# Altium schematic sheet Reference sche.SchDoc
size A2
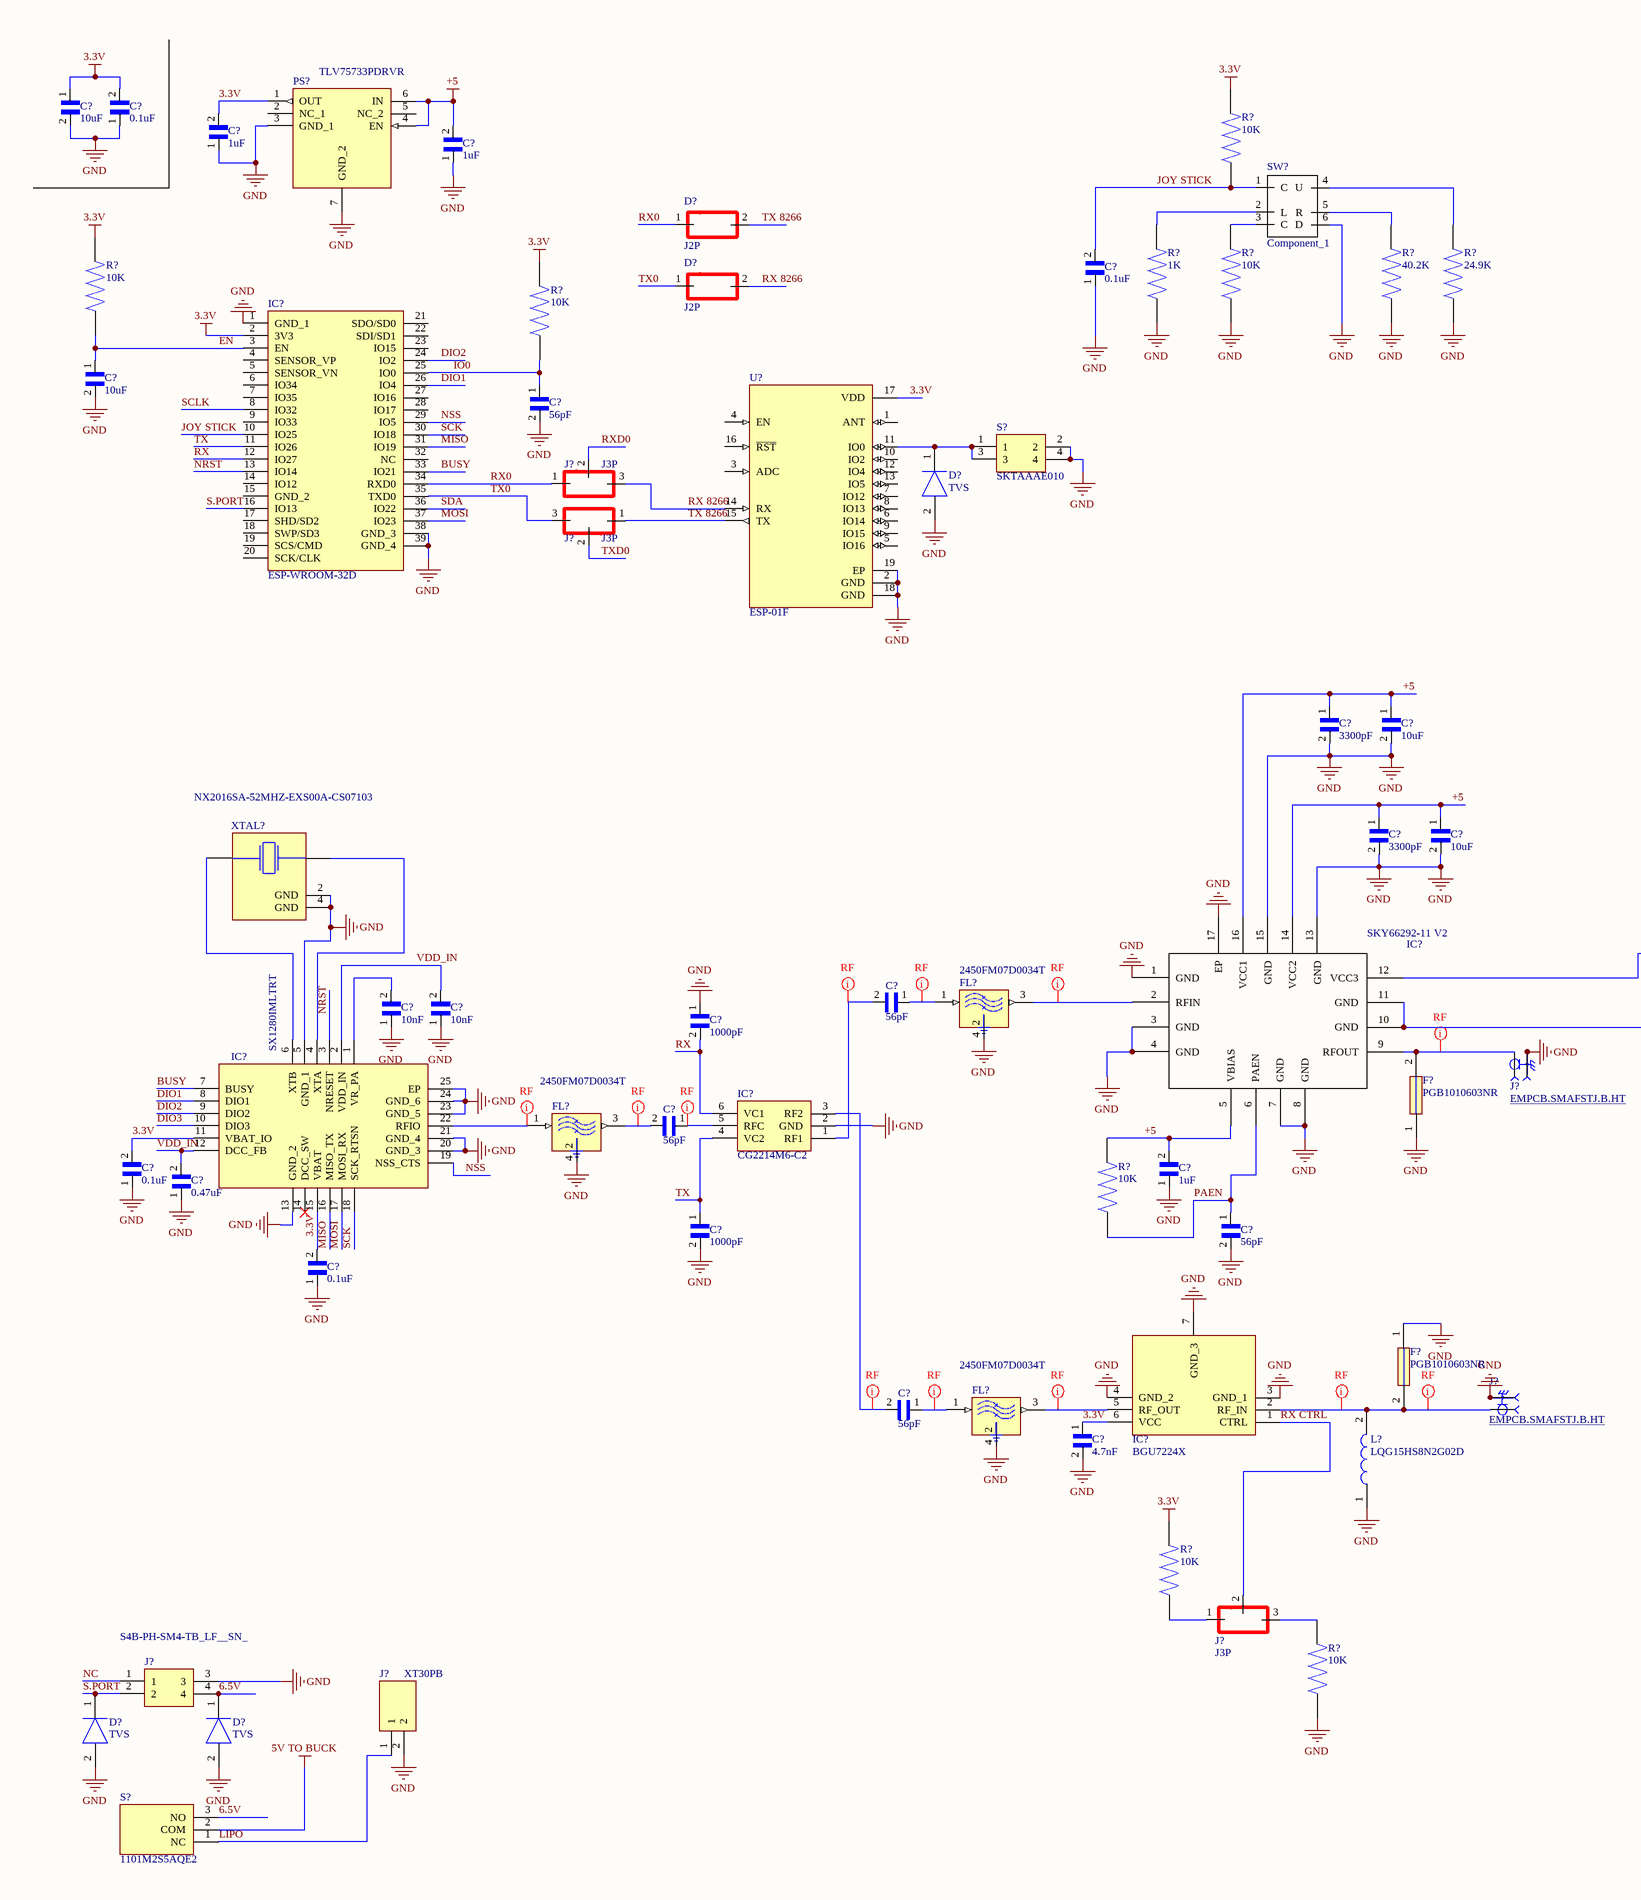
[diagram p0: Reference sche.SchDoc, left]
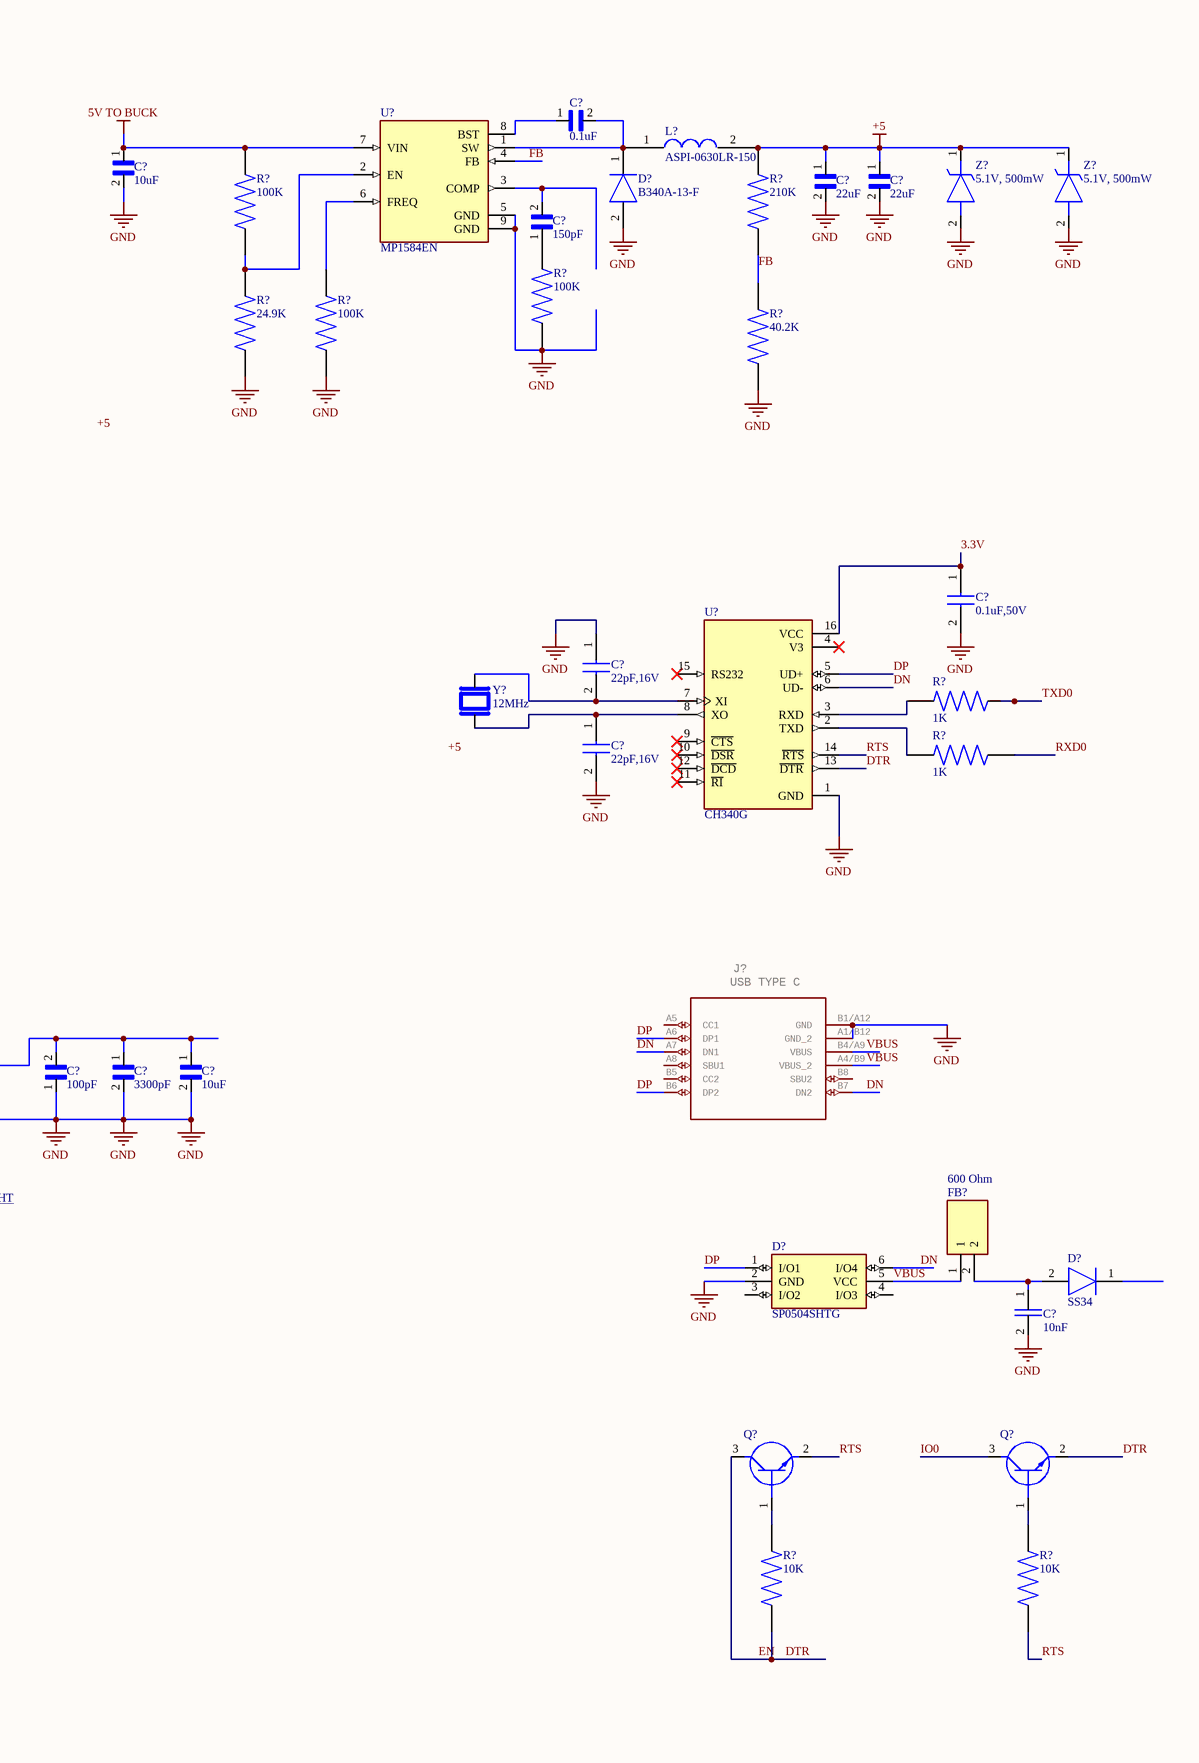
[diagram p1: Reference sche.SchDoc, right]

## Parts
(Parts that share a designator on the sheet are numbered #1, #2 ... from top to bottom, then left to right.)
C?#1  10uF  [CAPC2012X140N]
C?#2  0.1uF  [CAPC1005X56N]
C?#3  0.1uF  [CAPC1005X56N]
C?#4  1uF  [CAPC1608X100N]
C?#5  1uF  [CAPC1608X100N]
C?#6  10uF  [CAPC2012X140N]
C?#7  22uF  [CAPC2012X140N]
C?#8  22uF  [CAPC2012X140N]
C?#9  150pF  [CAPC1005X56N]
C?#10  0.1uF  [CAPC1005X56N]
C?#11  10uF  [CAPC2012X140N]
C?#12  56pF  [CAPC1005X56N]
C?#13  0.1uF,50V  [CAPC1608X08M]
C?#14  22pF,16V  [CAPC1608X08M]
C?#15  22pF,16V  [CAPC1608X08M]
C?#16  3300pF  [CAPC1005X56N]
C?#17  10uF  [CAPC2012X140N]
C?#18  3300pF  [CAPC1005X56N]
C?#19  10uF  [CAPC2012X140N]
C?#20  3300pF  [CAPC1005X56N]
C?#21  100pF  [CAPC1608X100N]
C?#22  10uF  [CAPC2012X140N]
C?#23  56pF  [CAPC1005X56N]
C?#24  10nF  [CAPC1608X100N]
C?#25  10nF  [CAPC1608X100N]
C?#26  1000pF  [CAPC1005X56N]
C?#27  56pF  [CAPC1005X56N]
C?#28  0.1uF  [CAPC1005X56N]
C?#29  1uF  [CAPC1608X100N]
C?#30  0.47uF  [CAPC1005X56N]
C?#31  10nF  [CAPC1608X08M]
C?#32  1000pF  [CAPC1005X56N]
C?#33  56pF  [CAPC1005X56N]
C?#34  0.1uF  [CAPC1005X56N]
C?#35  56pF  [CAPC1005X56N]
C?#36  4.7nF  [CAPC1005X56N]
D?#1  B340A-13-F  [DIOM5226X240N]
D?#2  J2P  [J2P]
D?#3  J2P  [J2P]
D?#4  TVS  [SODFL1608X70N]
D?#5  SP0504SHTG  [SOT95P280X145-6N]
D?#6  SS34  [DIOM5226X240N]
D?#7  TVS  [SODFL1608X70N]
D?#8  TVS  [SODFL1608X70N]
F?#1  PGB1010603NR  [FUSC1708X36N]
F?#2  PGB1010603NR  [FUSC1708X36N]
FB?  600 Ohm  [BEADC2012X105N]
FL?#1  2450FM07D0034T  [FIL_2450FM07D0034T]
FL?#2  2450FM07D0034T  [FIL_2450FM07D0034T]
FL?#3  2450FM07D0034T  [FIL_2450FM07D0034T]
IC?#1  ESP-WROOM-32D  [ESPWROOM32D]
IC?#2  SKY66292-11 V2  [SKY66292-11]
IC?#3  SX1280IMLTRT  [QFN50P400X400X100-25N-D]
IC?#4  CG2214M6-C2  [SOTFL48P130X55-6N]
IC?#5  BGU7224X  [SON50P160X160X50-7N]
J?#1  J3P  [J3P]
J?#2  J3P  [J3P]
J?#3  USB TYPE C  [2171790001_MOL]
J?#4  EMPCB.SMAFSTJ.B.HT  [TAOGLAS_EMPCB.SMAFSTJ.B.HT]
J?#5  EMPCB.SMAFSTJ.B.HT  [TAOGLAS_EMPCB.SMAFSTJ.B.HT]
J?#6  J3P  [J3P]
J?#7  S4B-PH-SM4-TB_LF__SN_  [S4B-PH-SM4-TB]
J?#8  XT30PB  [XT30PB]
L?#1  ASPI-0630LR-150  [ASPI-0630LR-150]
L?#2  LQG15HS8N2G02D  [LQG15WH0N7B02D]
PS?  TLV75733PDRVR  [SON65P200X200X80-7N]
Q?#1  BC847AMTF  [SOT95P240X120-3N]  (value not drawn)
Q?#2  BC847AMTF  [SOT95P240X120-3N]  (value not drawn)
R?#1  10K  [RESC1005X37N]
R?#2  100K  [RESC1005X37N]
R?#3  210K  [RESC1005X37N]
R?#4  1K  [RESC1005X37N]
R?#5  10K  [RESC1005X37N]
R?#6  40.2K  [RESC1005X37N]
R?#7  24.9K  [RESC1005X37N]
R?#8  100K  [RESC1005X37N]
R?#9  10K  [RESC1005X37N]
R?#10  24.9K  [RESC1005X37N]
R?#11  100K  [RESC1005X37N]
R?#12  10K  [RESC1005X37N]
R?#13  40.2K  [RESC1005X37N]
R?#14  1K  [RESC1005X37N]
R?#15  1K  [RESC1005X37N]
R?#16  10K  [RESC1005X37N]
R?#17  10K  [RESC1005X37N]
R?#18  10K  [RESC1005X37N]
R?#19  10K  [RESC1005X37N]
R?#20  10K  [RESC1005X37N]
S?#1  SKTAAAE010  [SKTAAAE010]
S?#2  1101M2S5AQE2  [1101M2S5AQE2]
SW?  Component_1  [5 WAY SWITCH]
U?#1  MP1584EN  [SOIC127P600X170-9N]
U?#2  ESP-01F  [MODULE_ESP-01F]
U?#3  CH340G  [SOIC127P600X175-16N]
XTAL?  NX2016SA-52MHZ-EXS00A-CS07103  [OSCCC200X160X50N]
Y?  12MHz  [XTAL_SXT2248EE17-12.000MT]
Z?#1  5.1V, 500mW  [SOD3716X135N]
Z?#2  5.1V, 500mW  [SOD3716X135N]

## Nets
3.3V: C?#1.1 C?#2.2 C?#4.2 C?#13.1 C?#28.2 C?#34.2 C?#36.1 IC?#1.2(3V3) IC?#3.11(VBAT_IO) IC?#3.15(VBAT) IC?#5.6(VCC) PS?.1(OUT) R?#1.2 R?#9.2 R?#12.2 R?#19.2 U?#2.17(VDD) U?#3.16(VCC)
5V TO BUCK: C?#6.1 R?#2.2 S?#2.2(COM) U?#1.7(VIN)
+5: C?#5.2 C?#7.1 C?#8.1 C?#16.1 C?#17.1 C?#18.1 C?#19.1 C?#29.2 IC?#2.5(VBIAS) IC?#2.14(VCC2) IC?#2.16(VCC1) L?#1.2 PS?.4(EN) PS?.6(IN) R?#3.2 R?#16.2 Z?#1.1(K) Z?#2.1(K)
GND: C?#1.2 C?#2.1 C?#4.1 C?#5.1 C?#6.2 C?#7.2 C?#8.2 C?#10.1 C?#11.2 C?#12.2 C?#13.2 C?#14.1 C?#15.2 C?#16.2 C?#17.2 C?#18.2 C?#19.2 C?#20.2 C?#21.1 C?#22.2 C?#24.1 C?#25.1 C?#26.1 C?#28.1 C?#29.1 C?#30.1 C?#31.2 C?#32.2 C?#33.2 C?#34.1 C?#36.2 D?#1.2(A) D?#4.2(A) D?#5.2(GND) D?#7.2(A) D?#8.2(A) F?#1.1 F?#2.1 FL?#1.4(GND) FL?#2.4(GND) FL?#3.4(GND) IC?#1.1(GND_1) IC?#1.38(GND_3) IC?#1.39(GND_4) IC?#2.1(GND) IC?#2.3(GND) IC?#2.4(GND) IC?#2.7(GND) IC?#2.8(GND) IC?#2.10(GND) IC?#2.11(GND) IC?#2.13(GND) IC?#2.15(GND) IC?#2.17(EP) IC?#3.5(GND_1) IC?#3.13(GND_2) IC?#3.20(GND_3) IC?#3.21(GND_4) IC?#3.23(GND_5) IC?#3.24(GND_6) IC?#3.25(EP) IC?#4.2(GND) IC?#5.3(GND_1) IC?#5.4(GND_2) IC?#5.7(GND_3) J?#3.A1/B12(GND_2) J?#3.B1/A12(GND) J?#4.SH1 J?#4.SH2 J?#4.SH3 J?#4.SH4 J?#5.SH1 J?#5.SH2 J?#5.SH3 J?#5.SH4 J?#7.3 J?#8.2 L?#2.1 PS?.3(GND_1) PS?.7(GND_2) R?#4.1 R?#5.1 R?#6.1 R?#7.1 R?#8.1 R?#10.1 R?#11.1 R?#13.1 R?#20.1 S?#1.2 S?#1.4 SW?.6(D) U?#1.5(GND) U?#1.9(GND) U?#2.2(GND) U?#2.18(GND) U?#2.19(EP) U?#3.1(GND) XTAL?.2(GND) XTAL?.4(GND) Z?#1.2(A) Z?#2.2(A)
6.5V: D?#8.1(K) J?#7.4 S?#2.3(NO)
BUSY: IC?#1.33(IO21) IC?#3.7(BUSY)
DIO1: IC?#1.26(IO4) IC?#3.8(DIO1)
DIO2: IC?#1.24(IO2) IC?#3.9(DIO2)
DIO3: IC?#3.10(DIO3)
DN: D?#5.6(I/O4) J?#3.A7(DN1) J?#3.B7(DN2) U?#3.6(UD-)
DP: D?#5.1(I/O1) J?#3.A6(DP1) J?#3.B6(DP2) U?#3.5(UD+)
DTR: C?#11.1 IC?#1.3(EN) Q?#1.3(C) Q?#2.2(E) R?#9.1 R?#17.1 U?#3.13(~{DTR})  [also labelled EN]
FB: R?#3.1 R?#13.2 U?#1.4(FB)
IO0: C?#12.1 IC?#1.25(IO0) Q?#2.3(C) R?#12.1
JOY STICK: C?#10.2 IC?#1.10(IO25) R?#1.1 SW?.1(C)
LIPO: J?#8.1 S?#2.1(NC)
MISO: IC?#1.31(IO19) IC?#3.16(MISO_TX)
MOSI: IC?#1.37(IO23) IC?#3.17(MOSI_RX)
NC: J?#7.1
NRST: IC?#1.13(IO14) IC?#3.3(NRESET)
NSS: IC?#1.29(IO5) IC?#3.19(NSS_CTS)
PAEN: C?#33.1 IC?#2.6(PAEN) R?#16.1
RTS: Q?#1.2(E) R?#18.1 U?#3.14(~{RTS})
RX: C?#26.2 IC?#1.12(IO27) IC?#4.6(VC1)
RX0: D?#2.1 IC?#1.34(RXD0) J?#1.1
RX 8266: D?#3.2 J?#1.3 U?#2.14(RX)
RX CTRL: IC?#5.1(CTRL) J?#6.2
RXD0: J?#1.2 R?#15.1
S.PORT: D?#7.1(K) IC?#1.16(IO13) J?#7.2
SCK: IC?#1.30(IO18) IC?#3.18(SCK_RTSN)
SCLK: IC?#1.8(IO32)
SDA: IC?#1.36(IO22)
TX: C?#32.1 IC?#1.11(IO26) IC?#4.4(VC2)
TX0: D?#3.1 IC?#1.35(TXD0) J?#2.3
TX 8266: D?#2.2 J?#2.1 U?#2.15(TX)
TXD0: J?#2.2 R?#14.1
VBUS: D?#5.5(VCC) FB?.1 J?#3.A4/B9(VBUS_2) J?#3.B4/A9(VBUS)
VDD_IN: C?#25.2 C?#30.2 IC?#3.2(VDD_IN) IC?#3.12(DCC_FB)
NetC?#3_1: C?#3.1 U?#1.8(BST)
NetC?#3_2: C?#3.2 D?#1.1(K) L?#1.1 U?#1.1(SW)
NetC?#9_1: C?#9.1 R?#8.2
NetC?#9_2: C?#9.2 U?#1.3(COMP)
NetC?#14_2: C?#14.2 U?#3.7(XI) Y?.3
NetC?#15_1: C?#15.1 U?#3.8(XO) Y?.1
NetC?#20_1: C?#20.1 C?#21.2 C?#22.1 IC?#2.12(VCC3)
NetC?#23_1: C?#23.1 FL?#1.1(IN)
NetC?#23_2: C?#23.2 IC?#4.1(RF1)
NetC?#24_2: C?#24.2 IC?#3.1(VR_PA)
NetC?#27_1: C?#27.1 IC?#4.5(RFC)
NetC?#27_2: C?#27.2 FL?#2.3(OUT)
NetC?#31_1: C?#31.1 D?#6.2(A) FB?.2
NetC?#35_1: C?#35.1 FL?#3.1(IN)
NetC?#35_2: C?#35.2 IC?#4.3(RF2)
NetD?#4_1: D?#4.1(K) S?#1.1 S?#1.3 U?#2.11(IO0)
NetF?#1_2: F?#1.2 IC?#2.9(RFOUT) J?#4.1
NetF?#2_2: F?#2.2 IC?#5.2(RF_IN) J?#5.1 L?#2.2
NetFL?#1_3: FL?#1.3(OUT) IC?#2.2(RFIN)
NetFL?#2_1: FL?#2.1(IN) IC?#3.22(RFIO)
NetFL?#3_3: FL?#3.3(OUT) IC?#5.5(RF_OUT)
NetIC?#3_4: IC?#3.4(XTA) XTAL?.3(B)
NetIC?#3_6: IC?#3.6(XTB) XTAL?.1(A)
NetJ?#6_1: J?#6.1 R?#19.1
NetJ?#6_3: J?#6.3 R?#20.2
NetQ?#1_1: Q?#1.1(B) R?#17.2
NetQ?#2_1: Q?#2.1(B) R?#18.2
NetR?#2_1: R?#2.1 R?#10.2 U?#1.2(EN)
NetR?#4_2: R?#4.2 SW?.2(L)
NetR?#5_2: R?#5.2 SW?.3(C)
NetR?#6_2: R?#6.2 SW?.5(R)
NetR?#7_2: R?#7.2 SW?.4(U)
NetR?#11_2: R?#11.2 U?#1.6(FREQ)
NetR?#14_2: R?#14.2 U?#3.3(RXD)
NetR?#15_2: R?#15.2 U?#3.2(TXD)

Not connected (* = marked no-connect by the designer): D?#5 3(I/O2) 4(I/O3); D?#6 1(K); FL?#1 2(GND); FL?#2 2(GND); FL?#3 2(GND); IC?#1 4(SENSOR_VP) 5(SENSOR_VN) 6(IO34) 7(IO35) 9(IO33) 14(IO12) 15(GND_2) 17(SHD/SD2) 18(SWP/SD3) 19(SCS/CMD) 20(SCK/CLK) 21(SDO/SD0) 22(SDI/SD1) 23(IO15) 27(IO16) 28(IO17) 32(NC); IC?#3 14(DCC_SW)*; J?#3 A5(CC1) A8(SBU1) B5(CC2) B8(SBU2); PS? 2(NC_1) 5(NC_2); U?#2 1(ANT) 3(ADC) 4(EN) 5(IO16) 6(IO14) 7(IO12) 8(IO13) 9(IO15) 10(IO2) 12(IO4) 13(IO5) 16(~{RST}); U?#3 4(V3)* 9(~{CTS})* 10(~{DSR})* 11(~{RI})* 12(~{DCD})* 15(RS232)*

## Layout directives
net class RF: NetC?#23_1, NetC?#23_2, NetC?#27_1, NetC?#27_2, NetC?#35_1, NetC?#35_2, NetF?#1_2, NetF?#2_2, NetFL?#1_3, NetFL?#2_1, NetFL?#3_3

## Notes on the sheet
- Labels drawn without touching a wire or pin: +5

## Library data of the parts
C?#1 C?#6-C?#8 C?#11 C?#17 C?#19 C?#22 = CL21B104KBCNNNC: Cap Ceramic 0.1uF 50VDC X7R 10% SMD 0805 Paper T/R; MF: {'manufacturer': u'Samsung'}; Availability: Unavailable; Package: None; MP: CL21B104KBCNNNC; Value: *; Price: None
C?#2 C?#3 C?#9 C?#10 C?#12 C?#16 C?#18 C?#20 C?#23 C?#26-C?#28 C?#30 C?#32-C?#36 = 04025C104KAT2A: CAP, MLCC, X7R, 0.1UF, 50V, 0402; MF: {'manufacturer': u'AVX'}; Availability: Unavailable; Package: None; MP: 04025C104KAT2A; Value: *; Price: None
C?#4 C?#5 C?#21 C?#24 C?#25 C?#29 = CL10F104ZB8NNNC: Capacitor 0603 0.1uF Y5V; MF: {'manufacturer': u'Samsung'}; Availability: Unavailable; Package: None; MP: CL10F104ZB8NNNC; Value: *; Price: None
C?#13 = CL10B104KB8NNNL: Capacitor; Manufacturer: Samsung Electro-Mechanics; Component Name: 0.1 µF ±10% 50V Ceramic Capacitor X7R 0603 (1608 Metric); Unit Price/(500pcs): ₹ 0.72; MFR Part no: CL10B104KB8NNNL; Package: 0603 [1608 Metric]
C?#14 C?#15 = CL10B105KP8NNNC: Capacitor; MFR Part no: 0603YA220KAT2A; Manufacturer: KYOCERA AVX; Unit Price/(500pcs): ₹ 0.77; Component Name: 22PF ,16V; Package: 0603 (1608 Metric)
C?#31 = C0603: Component Name: *; MFR Part no: *; Manufacturer: *; Unit Price/(500pcs): *; Package: *
D?#1 = B340A-13-F: Diode; Manufacturer_Name: Diodes Inc.; Datasheet Link: https://datasheet.datasheetarchive.com/originals/distributors/Datasheets-305/73551.pdf; Height: 2.4mm; Manufacturer_Part_Number: B340A-13-F; Mouser Part Number: 621-B340A-F; Mouser Price/Stock: https://www.mouser.co.uk/ProductDetail/Diodes-Incorporated/B340A-13-F?qs=aLaTXeBcTP9fj%2FYKVo6Q1A%3D%3D; Arrow Part Number: B340A-13-F; Arrow Price/Stock: https://www.arrow.com/en/products/b340a-13-f/diodes-incorporated?region=nac
D?#4 D?#7 D?#8 = ESD5Z3.3T1G: Diode; Manufacturer_Name: ON Semiconductor; Manufacturer: ONSEMI; Component Name: TVS Diode, ESD5Z Series, Unidirectional, 3.3 V; Unit Price/(500pcs): ₹ 5.98; Datasheet Link: http://www.onsemi.com/pub/Collateral/ESD5Z2.5T1-D.PDF; Height: 0.7mm; Manufacturer_Part_Number: ESD5Z3.3T1G; Mouser Part Number: 863-ESD5Z3.3T1G; Mouser Price/Stock: https://www.mouser.co.uk/ProductDetail/onsemi/ESD5Z33T1G?qs=OSf9jACorvaH3Y8oRWEcuQ%3D%3D; Arrow Part Number: ESD5Z3.3T1G; Arrow Price/Stock: https://www.arrow.com/en/products/esd5z3.3t1g/on-semiconductor?region=nac; MFR Part no: ESD5Z3.3T1G; Package: SOD-523-2
D?#5 = SP0504SHTG: Diode; Manufacturer_Name: LITTELFUSE; Manufacturer: LITTLE FUSE; Component Name: ESD TVS DIODE; Unit Price/(500pcs): ₹ 23.57; Datasheet Link: http://www.littelfuse.com/~/media/electronics/datasheets/tvs_diode_arrays/littelfuse_tvs_diode_array_sp0504s_datasheet.pdf.pdf; Height: 1.45mm; Manufacturer_Part_Number: SP0504SHTG; Mouser Part Number: 576-SP0504SHTG; Mouser Price/Stock: https://www.mouser.co.uk/ProductDetail/Littelfuse/SP0504SHTG?qs=VPR2Pdj9HgCFO7boWWEmwA%3D%3D; Arrow Part Number: SP0504SHTG; Arrow Price/Stock: https://www.arrow.com/en/products/sp0504shtg/littelfuse?region=nac; MFR Part no: SP0504SHTG; Package: SOT23
D?#6 = B340A-13-F: Diode; Manufacturer: SUNROM; Component Name: SCHOTTKY DIODE; Unit Price/(500pcs): 4.25; Package: DO-214AC; MFR Part no: SUNROM 4447
F?#1 F?#2 = PGB1010603NR: Fuse; Manufacturer_Name: LITTELFUSE; Manufacturer: Littelfuse Inc.; Component Name: TVS DIODE 24VWM 150VC 0603; Unit Price/(500pcs): ₹ 26.71; Datasheet Link: https://componentsearchengine.com/Datasheets/2/PGB1010603NR.pdf; Height: 0.36mm; Manufacturer_Part_Number: PGB1010603NR; Mouser Part Number: 576-PGB1010603NR; Mouser Price/Stock: https://www.mouser.co.uk/ProductDetail/Littelfuse/PGB1010603NR?qs=gu7KAQ731UTJOoBJUwB8FA%3D%3D; Arrow Part Number: PGB1010603NR; Arrow Price/Stock: https://www.arrow.com/en/products/pgb1010603nr/littelfuse?region=nac; MFR Part no: PGB1010603NR; Package: 0603 [1608 Metric]
FB? = MPZ2012S221A: Ferrite Bead; MFR Part no: MMZ2012Y601BT000; Manufacturer: TDK; Unit Price/(500pcs): ₹ 2.48; Component Name: 600 OHM; Package: 0805 (2012 Metric)
FL?#1-FL?#3 = 2450FM07D0034T: 2.4GHz ~ 2.5GHz Frequency RF Filter (Radio Frequency) 100MHz Bandwidth 0.75dB 0402 (1005 Metric), 4 PC Pad; MF: {'manufacturer': u'Johanson Technology Inc.'}; Value: *; Availability: Unavailable; Price: None; Package: None; MP: 2450FM07D0034T
IC?#1 = ESP-WROOM-32D: Integrated Circuit; Manufacturer_Name: Espressif Systems; Datasheet Link: https://componentsearchengine.com/Datasheets/1/ESP-WROOM-32D.pdf; Height: 3.2mm; Manufacturer_Part_Number: ESP-WROOM-32D; Mouser Part Number: 356-ESP-WROOM-32D; Mouser Price/Stock: https://www.mouser.co.uk/ProductDetail/Espressif-Systems/ESP-WROOM-32D?qs=MLItCLRbWsyWVKgdQMcFuQ%3D%3D
IC?#3 = SX1280IMLTRT: Integrated Circuit; Manufacturer_Name: SEMTECH; Datasheet Link: https://datasheet.datasheetarchive.com/originals/distributors/DKDS-37/728740.pdf; Height: 1mm; Manufacturer_Part_Number: SX1280IMLTRT; Mouser Part Number: 947-SX1280IMLTRT; Mouser Price/Stock: https://www.mouser.co.uk/ProductDetail/Semtech/SX1280IMLTRT?qs=5aG0NVq1C4xuoq8G6ZzdxQ%3D%3D; Arrow Part Number: SX1280IMLTRT; Arrow Price/Stock: https://www.arrow.com/en/products/sx1280imltrt/semtech
IC?#4 = CG2214M6-C2: Integrated Circuit; Manufacturer_Name: CEL; Datasheet Link: http://www.cel.com/pdf/datasheets/CG2214M6.pdf; Height: 0.55mm; Manufacturer_Part_Number: CG2214M6-C2; Mouser Part Number: 551-CG2214M6-C2; Mouser Price/Stock: https://www.mouser.co.uk/ProductDetail/CEL/CG2214M6-C2?qs=tucQmhgEO3pgt47Dr78trg%3D%3D; Arrow Part Number: CG2214M6-C2; Arrow Price/Stock: https://www.arrow.com/en/products/cg2214m6-c2/california-eastern-laboratories
IC?#5 = BGU7224X: Integrated Circuit; Manufacturer_Name: NXP; Datasheet Link: http://www.nxp.com/docs/en/data-sheet/BGU7224.pdf; Height: 0.5mm; Manufacturer_Part_Number: BGU7224X; Mouser Part Number: 771-BGU7224X; Mouser Price/Stock: https://www.mouser.co.uk/ProductDetail/NXP-Semiconductors/BGU7224X?qs=Sd2AGZv2AHkyYARpdSjAzA%3D%3D; Arrow Part Number: BGU7224X; Arrow Price/Stock: https://www.arrow.com/en/products/bgu7224x/nxp-semiconductors
J?#3 = 2171790001: MFR_NAME: Molex Connector Corporation; MFR Part no: 5365; Manufacturer: SUNROM; GateName_1: A; Unit Price/(500pcs): ₹ 36.34; SymbolName_1: 2171790001; LibraryName: TYPE C; DeviceSetName: 2171790001; COPYRIGHT: Copyright (C) 2021 Ultra Librarian. All rights reserved.; DIGI-KEY_PART_NUMBER_1: 900-2171790001TR-ND; DIGI-KEY_PART_NUMBER_2: 900-2171790001CT-ND; DIGI-KEY_PART_NUMBER_3: 900-2171790001DKR-ND; MANUFACTURER_PART_NUMBER: 2171790001; Component Name: USB TYPE C; Package: THROUGH HOLE
J?#4 J?#5 = EMPCB.SMAFSTJ.B.HT: SMA Connector Jack, Female Socket 50Ohm Board Edge, End Launch Solder; MF: Taoglas Limited; Value: *; Package: None; Digi-Key_Part_Number: 931-1175-ND; Digi-Key_Purchase_URL: https://www.digikey.com/product-detail/en/taoglas-limited/EMPCB.SMAFSTJ.B.HT/931-1175-ND/3522337?utm_source=snapeda&utm_medium=aggregator&utm_campaign=symbol; MP: EMPCB.SMAFSTJ.B.HT; SnapEDA_Link: https://www.snapeda.com/parts/EMPCB.SMAFSTJ.B.HT/Taoglas%20Limited/view-part/231078/?ref=snap
J?#7 = S4B-PH-SM4-TB_LF__SN_: Connector; Manufacturer_Name: JST (JAPAN SOLDERLESS TERMINALS); Manufacturer_Part_Number: S4B-PH-SM4-TB(LF)(SN); Datasheet Link: http://uk.rs-online.com/web/p/products/6881366; Arrow Part Number: S4B-PH-SM4-TB(LF)(SN); Arrow Price/Stock: https://www.arrow.com/en/products/s4b-ph-sm4-tb-lf-sn/jst-manufacturing
J?#8 = XT30PB: Connector; Manufacturer_Name: Amass; Datasheet Link: https://www.tme.eu/Document/4acc913878197f8c2e30d4b8cdc47230/XT30UPB%20SPEC.pdf; Height: 10.7mm; Manufacturer_Part_Number: XT30PB
L?#2 = LQG15HS8N2G02D: Inductor; Manufacturer_Name: Murata Electronics; Datasheet Link: https://psearch.en.murata.com/inductor/product/LQG15HS8N2G02%23.html; Height: 0.55mm; Manufacturer_Part_Number: LQG15HS8N2G02D; Mouser Part Number: 81-LQG15HS8N2G02D; Mouser Price/Stock: https://www.mouser.co.uk/ProductDetail/Murata-Electronics/LQG15HS8N2G02D?qs=d0WKAl%252BL4KapDveqKJ4FDA%3D%3D
PS? = TLV75733PDRVR: Power Supply; Manufacturer_Name: Texas Instruments; Datasheet Link: http://www.ti.com/lit/gpn/tlv757p; Height: 0.8mm; Manufacturer_Part_Number: TLV75733PDRVR; Mouser Part Number: 595-TLV75733PDRVR; Mouser Price/Stock: https://www.mouser.co.uk/ProductDetail/Texas-Instruments/TLV75733PDRVR?qs=W0yvOO0ixfGlytsi33vetg%3D%3D; Arrow Part Number: TLV75733PDRVR; Arrow Price/Stock: https://www.arrow.com/en/products/tlv75733pdrvr/texas-instruments?region=nac
Q?#1 Q?#2 = BC847AMTF: Transistor BJT NPN; Manufacturer_Name: ON Semiconductor; MFR Part no: BC847; Manufacturer: ONSEMI; Unit Price/(500pcs): ₹ 4.83; Datasheet Link: http://www.onsemi.com/pub/Collateral/BC846-D.PDF; Height: 1.2mm; Manufacturer_Part_Number: BC847AMTF; Mouser Part Number: 512-BC847AMTF; Mouser Price/Stock: https://www.mouser.com/Search/Refine.aspx?Keyword=512-BC847AMTF; Arrow Part Number: BC847AMTF; Arrow Price/Stock: https://www.arrow.com/en/products/bc847amtf/on-semiconductor; Component Name: TRANSISTOR; Package: SOT23
R?#1-R?#20 = RE0402BRE07330KL: MF: {'manufacturer': u'Yageo'}; Availability: Unavailable; Package: None; MP: RE0402BRE07330KL; Value: *; Price: None
S?#1 = SKTAAAE010: Switch; Manufacturer_Name: ALPS; Datasheet Link: https://componentsearchengine.com/Datasheets/1/SKTAAAE010.pdf; Height: 0.63mm; Manufacturer_Part_Number: SKTAAAE010; Mouser Part Number: 688-SKTAAAE010; Mouser Price/Stock: https://www.mouser.co.uk/ProductDetail/ALPS/SKTAAAE010?qs=u4fy%2FsgLU9NVRRqWeykmWg%3D%3D
S?#2 = 1101M2S5AQE2: Switch; Manufacturer_Name: C & K COMPONENTS; Manufacturer: SUNROM; Component Name: SPDT SWITCH THROUGH HOLE; Unit Price/(500pcs): 15.23; Datasheet Link: https://www.arrow.com/en/products/1101m2s5aqe2/ck; Height: 6.6mm; Manufacturer_Part_Number: 1101M2S5AQE2; Mouser Part Number: 611-1101M2S5AQE2; Mouser Price/Stock: https://www.mouser.co.uk/ProductDetail/CK/1101M2S5AQE2?qs=lwH5WijZ8egIsHAjqlMdZA%3D%3D; Arrow Part Number: 1101M2S5AQE2; Arrow Price/Stock: https://www.arrow.com/en/products/1101m2s5aqe2/ck?region=nac; MFR Part no: SUNROM 5263; Package: THROUGH HOLE
U?#1 = MP1584EN: 3A, 1.5MHz, 28V Step-Down Converter; MF: {'manufacturer': u'Monolithic Power'}; Availability: Unavailable; Package: None; MP: MP1584EN; Value: *; Price: None
U?#2 = ESP-01F: 802.11b/g/n Wi-Fi SOC module; MF: AI-Thinker; SnapEDA_Link: https://www.snapeda.com/parts/ESP-01F/AI-Thinker/view-part/5470732/?ref=snap; Availability: Unavailable; Price: None; Package: Package; Check_prices: https://www.snapeda.com/parts/ESP-01F/AI-Thinker/view-part/5470732/?ref=eda; Value: *; MP: ESP-01F
XTAL? = NX2016SA-52MHZ-EXS00A-CS07103: CRYSTAL 52MHZ 10PF SMD; MF: {'manufacturer': u'NDK America, Inc.'}; Value: *; Availability: Unavailable; Price: None; Package: None; MP: NX2016SA-52MHZ-EXS00A-CS07103
Y? = SXT2248EE17-12.000MT: MF: {'manufacturer': u'Suntsu'}; Package: None; Value: *; Availability: Unavailable; MP: SXT2248EE17-12.000MT; Price: None
Z?#1 Z?#2 = MMSZ5231BT1G: Zener Diode; Manufacturer_Name: ON Semiconductor; Manufacturer: ONSEMI; Component Name: 5.1V 500mW; Unit Price/(500pcs): ₹ 6.57; Datasheet Link: http://www.onsemi.com/pub_link/Collateral/MMSZ5221BT1-D.PDF; Height: 1.35mm; Manufacturer_Part_Number: MMSZ5231BT1G; Mouser Part Number: 863-MMSZ5231BT1G; Mouser Price/Stock: https://www.mouser.co.uk/ProductDetail/onsemi/MMSZ5231BT1G?qs=P4IOph%252Bbot%2FUEpHENPMrdw%3D%3D; Arrow Part Number: MMSZ5231BT1G; Arrow Price/Stock: https://www.arrow.com/en/products/mmsz5231bt1g/on-semiconductor?region=nac; MFR Part no: MMSZ5231BT1G; Package: SOD123
U?#3 = CH340G: Package: None